# Altium project 基于单片机的光控计数器的设计.PrjPCB
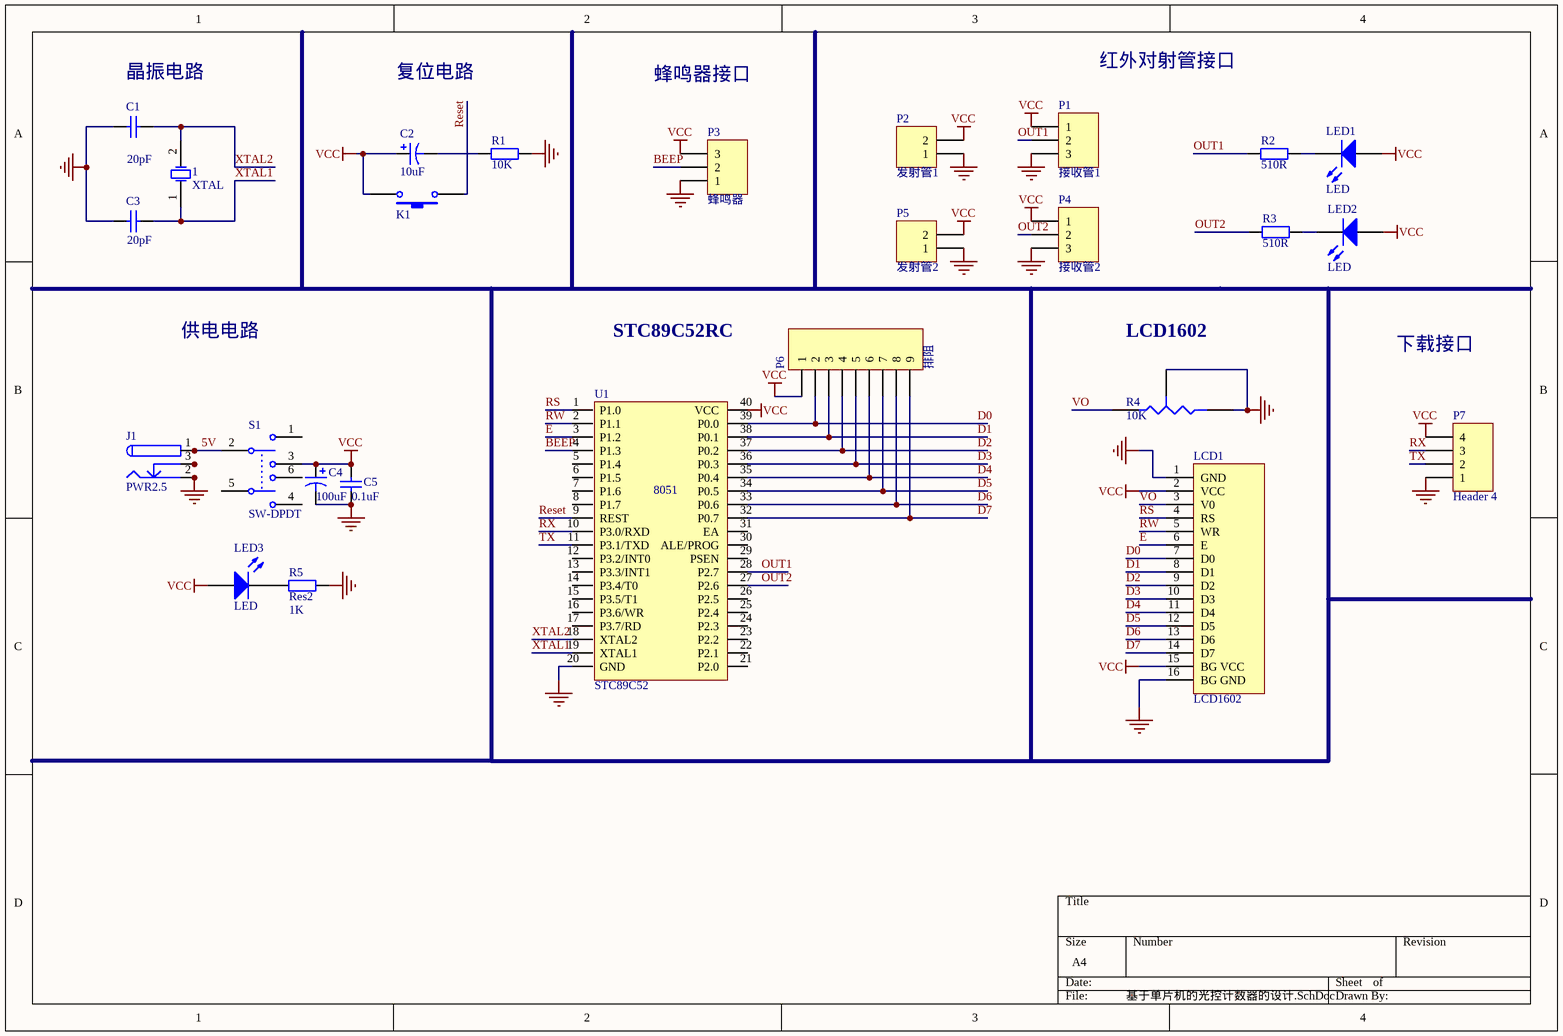
[diagram p0: 基于单片机的光控计数器的设计.SchDoc]
1 sheet, 26 parts. Net scope: global (net labels, ports and power ports of the same name join across sheets).
Board file: 基于单片机的光控计数器的设计.PcbDoc

## Sheet 基于单片机的光控计数器的设计.SchDoc
size A4

### Parts
1  XTAL  [XTAL]
C1  value 20pF  [RAD-0.1]  (hidden comment: Cap)
C2  value 10uF  [RB.1/.2]  (hidden comment: Cap Pol1)
C3  value 20pF  [RAD-0.1]  (hidden comment: Cap)
C4  value 100uF  [RB.1/.2]  (hidden comment: Cap Pol1)
C5  value 0.1uF  [RAD-0.1]  (hidden comment: Cap)
J1  PWR2.5  [KLD-0202]
K1  四脚按键  [四脚按键]  (value not drawn)
LCD1  LCD1602  [LCD1602]
LED1  LED  [LED]
LED2  LED  [LED]
LED3  LED  [LED]
P1  接收管1  [HDR1X3]
P2  发射管1  [HDR1X2]
P3  蜂鸣器  [HDR1X3]
P4  接收管2  [HDR1X3]
P5  发射管2  [HDR1X2]
P6  排阻  [HDR1X9]
P7  Header 4  [HDR1X4]
R1  value 10K  [AXIAL-0.4]  (hidden comment: Res2)
R2  value 510R  [AXIAL-0.4]  (hidden comment: Res2)
R3  value 510R  [AXIAL-0.4]  (hidden comment: Res2)
R4  value 10K  [电位器]  (hidden comment: Res Tap)
R5  Res2  value 1K  [AXIAL-0.4]
S1  SW-DPDT  [SWITCH_B1]
U1  STC89C52  [DIP-40]

### Nets
GND: C1.2 C3.2 C4.2 C5.1 J1.2 J1.2A J1.2B LCD1.1(GND) LCD1.16(BG_GND) P1.3 P2.1 P3.1 P4.3 P5.1 P7.1 R1.1 R4.2(B) R4.3(TAP) R5.2 U1.20(GND)
VCC: C2.1 C4.1 C5.2 K1.1 LCD1.2(VCC) LCD1.15(BG_VCC) LED1.1 LED2.1 LED3.1 P1.1 P2.2 P3.3 P4.1 P5.2 P6.1 P7.4 S1.3 U1.40(VCC)
5V: J1.1 J1.1A J1.1B S1.2
BEEP: P3.2 U1.4(P1.3)
D0: LCD1.7(D0) P6.2 U1.39(P0.0)
D1: LCD1.8(D1) P6.3 U1.38(P0.1)
D2: LCD1.9(D2) P6.4 U1.37(P0.2)
D3: LCD1.10(D3) P6.5 U1.36(P0.3)
D4: LCD1.11(D4) P6.6 U1.35(P0.4)
D5: LCD1.12(D5) P6.7 U1.34(P0.5)
D6: LCD1.13(D6) P6.8 U1.33(P0.6)
D7: LCD1.14(D7) P6.9 U1.32(P0.7)
E: LCD1.6(E) U1.3(P1.2)
OUT1: P1.2 R2.1 U1.28(P2.7)
OUT2: P4.2 R3.1 U1.27(P2.6)
Reset: K1.2 U1.9(REST)
RS: LCD1.4(RS) U1.1(P1.0)
RW: LCD1.5(WR) U1.2(P1.1)
RX: P7.3 U1.10(P3.0/RXD)
TX: P7.2 U1.11(P3.1/TXD)
VO: LCD1.3(V0) R4.1(A)
XTAL1: 1.1(OSC1) C3.1 U1.19(XTAL1)
XTAL2: 1.2(OSC2) C1.1 U1.18(XTAL2)
NetC2_2: C2.2 R1.2
NetJ1_3: J1.3 J1.3A J1.3B
NetLED1_2: LED1.2 R2.2
NetLED2_2: LED2.2 R3.2
NetLED3_2: LED3.2 R5.1

Not connected (* = marked no-connect by the designer): S1 1 4 5 6; U1 5(P1.4) 6(P1.5) 7(P1.6) 8(P1.7) 12(P3.2/INT0) 13(P3.3/INT1) 14(P3.4/T0) 15(P3.5/T1) 16(P3.6/WR) 17(P3.7/RD) 21(P2.0) 22(P2.1) 23(P2.2) 24(P2.3) 25(P2.4) 26(P2.5) 29(PSEN) 30(ALE/PROG) 31(EA)

### Notes on the sheet
- (near C1) 晶振电路
- 复位电路
- 蜂鸣器接口
- 红外对射管接口
- 供电电路
- STC89C52RC
- LCD1602
- 下载接口
- (in symbol STC89C51) 8051

### Library data of the parts
1 = XTAL: Crystal Oscillator; Published: 8-Jun-2000; LatestRevisionDate: 17-Jul-2002; LatestRevisionNote: Re-released for DXP Platform.; PackageReference: R38; Publisher: Altium Limited; PackageDescription: Crystal, Thru-Hole; 2 Leads; Body 3.1 x 8.2 mm (Dia.xH)
C1 C3 C5 = Cap: Capacitor; Published: 8-Jun-2000; LatestRevisionDate: 17-Jul-2002; LatestRevisionNote: Re-released for DXP Platform.; PackageReference: RAD-0.3; Publisher: Altium Limited; PackageDescription: Radial Cap, Thru-Hole; 2 Leads; 0.3 in Pin Spacing
C2 C4 = Cap Pol1: Polarized Capacitor (Radial); Published: 8-Jun-2000; LatestRevisionDate: 17-Jul-2002; LatestRevisionNote: Re-released for DXP Platform.; PackageReference: RB7.6-15; Publisher: Altium Limited; PackageDescription: Polarized Capacitor (Radial); 2 Leads
J1 = PWR2.5: Low Voltage Power Supply Connector; Published: 17-Dec-2003; DatasheetDocument: 09-May-2002; Publisher: Altium Limited; ComponentLink1Description: Manufacturer Link; ComponentLink1URL: http://domino.kycon.com/internet/Products.html
P1 P3 P4 = Header 3: Header, 3-Pin; LatestRevisionDate: 17-Jul-2002; LatestRevisionNote: Re-released for DXP Platform.; Publisher: Altium Limited
P2 P5 = Header 2: Header, 2-Pin; LatestRevisionDate: 17-Jul-2002; LatestRevisionNote: Re-released for DXP Platform.; Publisher: Altium Limited
P6 = Header 9: Header, 9-Pin; LatestRevisionDate: 17-Jul-2002; LatestRevisionNote: Re-released for DXP Platform.; Publisher: Altium Limited
P7 = Header 4: Header, 4-Pin; LatestRevisionDate: 17-Jul-2002; LatestRevisionNote: Re-released for DXP Platform.; Publisher: Altium Limited
R1-R3 R5 = Res2: Resistor; Published: 8-Jun-2000; LatestRevisionDate: 17-Jul-2002; LatestRevisionNote: Re-released for DXP Platform.; PackageReference: AXIAL-0.4; Publisher: Altium Limited; PackageDescription: Axial Device, Thru-Hole; 2 Leads; 0.4 in Pin Spacing
R4 = Res Tap: Tapped Resistor; Sim Note: Enter the Resistance value and the set point into parameter fields.; Set Position: 0.5; Published: 24-Mar-1999; LatestRevisionDate: 17-Jul-2002; LatestRevisionNote: Re-released for DXP Platform.; PackageReference: VR3; Publisher: Altium Limited; PackageDescription: Variable Resistor, Thru-Hole; 3 Leads
S1 = SW-DPDT: 单刀双掷开关; Published: 24-Mar-1999; LatestRevisionDate: 17-Jul-2002; LatestRevisionNote: Re-released for DXP Platform.; PackageReference: DPDT-6; Publisher: Altium Limited
U1 = STC89C51